# Altium project remora-2.PrjPCB
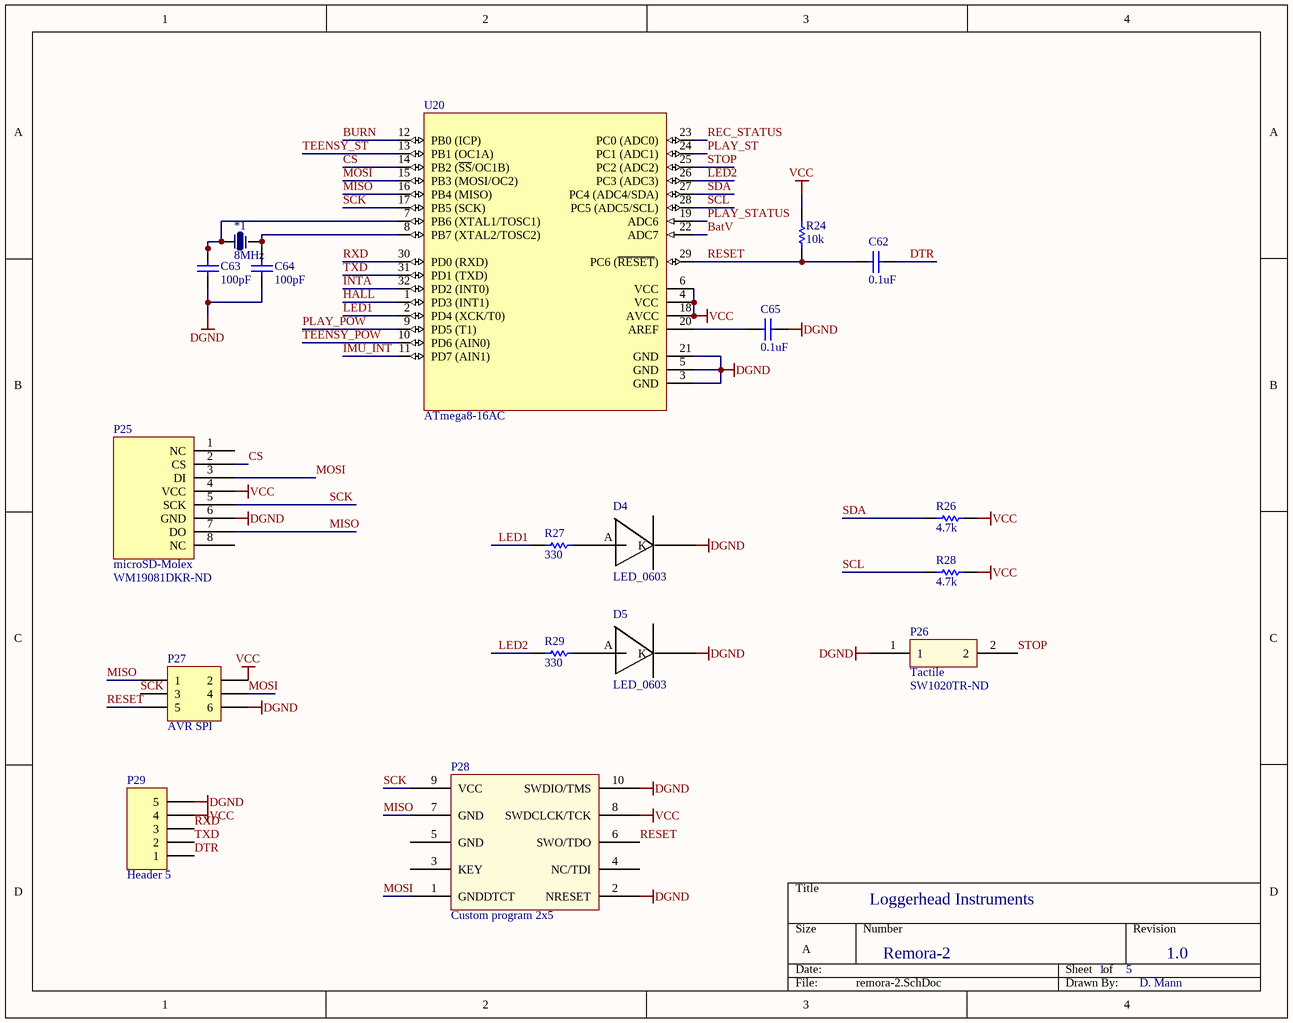
[diagram p0: remora-2.SchDoc]
5 sheets, 128 parts. Net scope: global (net labels, ports and power ports of the same name join across sheets).
Board file: remora-2.PcbDoc
Sheets:
  remora-2.SchDoc
  remora-2-sensors.SchDoc
  remora-2-power.SchDoc
  teensyRecord.SchDoc
  teensyPlayback.SchDoc

## Sheet remora-2.SchDoc
size A

### Parts
*1  8MHz  [XTAL-ABM3]
C62  0.1uF  [0402]
C63  100pF  [0402]
C64  100pF  [0402]
C65  0.1uF  [0402]
D4  LED_0603  [Diode0603]
D5  LED_0603  [Diode0603]
P25  microSD-Molex  Supplier Part Number 1: WM19081DKR-ND  [microSD_Molex_hinged]
P26  Tactile  Supplier Part Number 1: SW1020TR-ND  [Tactile-B3U-1000]
P27  AVR SPI  [HDR2X3]
P28  Custom program 2x5  [Header_2x5_50mil]
P29  Header 5  [HDR1X5]
R24  10k  [3-0603]
R26  4.7k  [3-0603]
R27  330  [3-0603]
R28  4.7k  [3-0603]
R29  330  [3-0603]
U20  ATmega8-16AC  [32M1-A_M]

### Nets
DGND: C63.1 C64.1 C65.2 D4.K D5.K P25.6(GND) P26.1 P27.6 P28.2(NRESET) P28.10(SWDIO/TMS) P29.5 U20.3(GND) U20.5(GND) U20.21(GND)
VCC: P25.4(VCC) P27.2 P28.8(SWDCLCK/TCK) P29.4 R24.2 R26.2 R28.2 U20.4(VCC) U20.6(VCC) U20.18(AVCC)
BatV: U20.22(ADC7)
BURN: U20.12(PB0_(ICP))
CS: P25.2(CS) U20.14(PB2_(~{SS}/OC1B))
DTR: C62.2 P29.1
HALL: U20.1(PD3_(INT1))
IMU_INT: U20.11(PD7_(AIN1))
INTA: U20.32(PD2_(INT0))
LED1: R27.1 U20.2(PD4_(XCK/T0))
LED2: R29.1 U20.26(PC3_(ADC3))
MISO: P25.7(DO) P27.1 P28.7(GND) U20.16(PB4_(MISO))
MOSI: P25.3(DI) P27.4 P28.1(GNDDTCT) U20.15(PB3_(MOSI/OC2))
PLAY_POW: U20.9(PD5_(T1))
PLAY_ST: U20.24(PC1_(ADC1))
PLAY_STATUS: U20.19(ADC6)
REC_STATUS: U20.23(PC0_(ADC0))
RESET: C62.1 P27.5 P28.6(SWO/TDO) R24.1 U20.29(PC6_(~{RESET}))
RXD: P29.3 U20.30(PD0_(RXD))
SCK: P25.5(SCK) P27.3 P28.9(VCC) U20.17(PB5_(SCK))
SCL: R28.1 U20.28(PC5_(ADC5/SCL))
SDA: R26.1 U20.27(PC4_(ADC4/SDA))
STOP: P26.2 U20.25(PC2_(ADC2))
TEENSY_POW: U20.10(PD6_(AIN0))
TEENSY_ST: U20.13(PB1_(OC1A))
TXD: P29.2 U20.31(PD1_(TXD))
Net*1_1: *1.1 C63.2 U20.7(PB6_(XTAL1/TOSC1))
Net*1_2: *1.2 C64.2 U20.8(PB7_(XTAL2/TOSC2))
NetC65_1: C65.1 U20.20(AREF)
NetD4_A: D4.A R27.2
NetD5_A: D5.A R29.2

Not connected (* = marked no-connect by the designer): P25 1(NC) 8(NC); P28 3(KEY) 4(NC/TDI) 5(GND)

### Notes on the sheet
- Loggerhead Instruments
- Remora-2
- 1
- 5
- 1.0
- D. Mann

### Library data of the parts
*1 = XTAL-ABM3
C62-C65 = C0402: Ceramic Chip Capacitor - Standard; Note: Footprint corresponds to dimensions for bulk cassette packaging. This case size has tightened tolerances.; Published: 17-Jul-2002; LatestRevisionDate: 19-Mar-2004; LatestRevisionNote: Silkscreen size reduced.; DatasheetDocument: Mar-2001; PackageDocument: Mar-2001; PackageReference: 0402; Publisher: Altium Limited; Code_JEITA: 0402; Code_IPC: 1005 [0402]; ComponentLink1Description: Manufacturer Link; ComponentLink1URL: http://www.kemet.com/; ComponentLink2Description: Datasheet; ComponentLink2URL: http://www.kemet.com/kemet/web/homepage/kechome.nsf/vapubfilesname/F3102TA.pdf/$file/F3102TA.pdf
  C62 C65: Value: 0.1uF
  C63 C64: Value: 100pF
P25 = microSD_Molex_hinged: Supplier 1: Digi-Key
P26 = Tactile_B3U-1000: Supplier 1: Digi-Key
P27 = Header 3X2: Header, 3-Pin, Dual row; LatestRevisionDate: 17-Jul-2002; LatestRevisionNote: Re-released for DXP Platform.; Publisher: Altium Limited
P28 = CortexDebug
P29 = Header 5: Header, 5-Pin; LatestRevisionDate: 17-Jul-2002; LatestRevisionNote: Re-released for DXP Platform.; Publisher: Altium Limited
R24 R26-R29 = ERJ3RK: Precision Thick Film Chip Resistor, 10 Ohm to 1M Ohm Range, 1% and 0.5% Tolerance, 0603 Size, 0.063 W; Published: 17-Dec-2003; LatestRevisionDate: 19-Mar-2004; LatestRevisionNote: Silkscreen size reduced.; PackageDocument: Mar-2003; PackageReference: 3-0603; Publisher: Altium Limited; Code_IPC: 1608 [0603]; ComponentLink1Description: Manufacturer Link; ComponentLink1URL: http://www.panasonic.com/industrial/components/resistive_products.htm; ComponentLink2Description: Datasheet; ComponentLink2URL: http://www.panasonic.com/industrial/components/pdf/AOA0000CE2.pdf
U20 = ATmega8-16AC: 8-Bit AVR Microcontroller with 8K Bytes of In-System Programmable Flash Memory; Published: 17-Sep-2003; LatestRevisionDate: 13-Apr-2006; LatestRevisionNote: IPC-7351 Footprint Added.; DatasheetVersion: 2486H-AVR-09/02; PackageVersion: revB, Oct-2001; PackageReference: 32A; Publisher: Altium Limited; PackageDescription: 32-Pin Thin Quad Flat Pack 0.8 mm Pitch; Code_JEDEC: MS-026-ABA; ComponentLink1Description: Manufacturer Link; ComponentLink1URL: http://www.atmel.com; ComponentLink2Description: Datasheet; ComponentLink2URL: http://www.atmel.com/dyn/resources/prod_documents/doc2486.pdf

## Sheet remora-2-sensors.SchDoc
size Legal
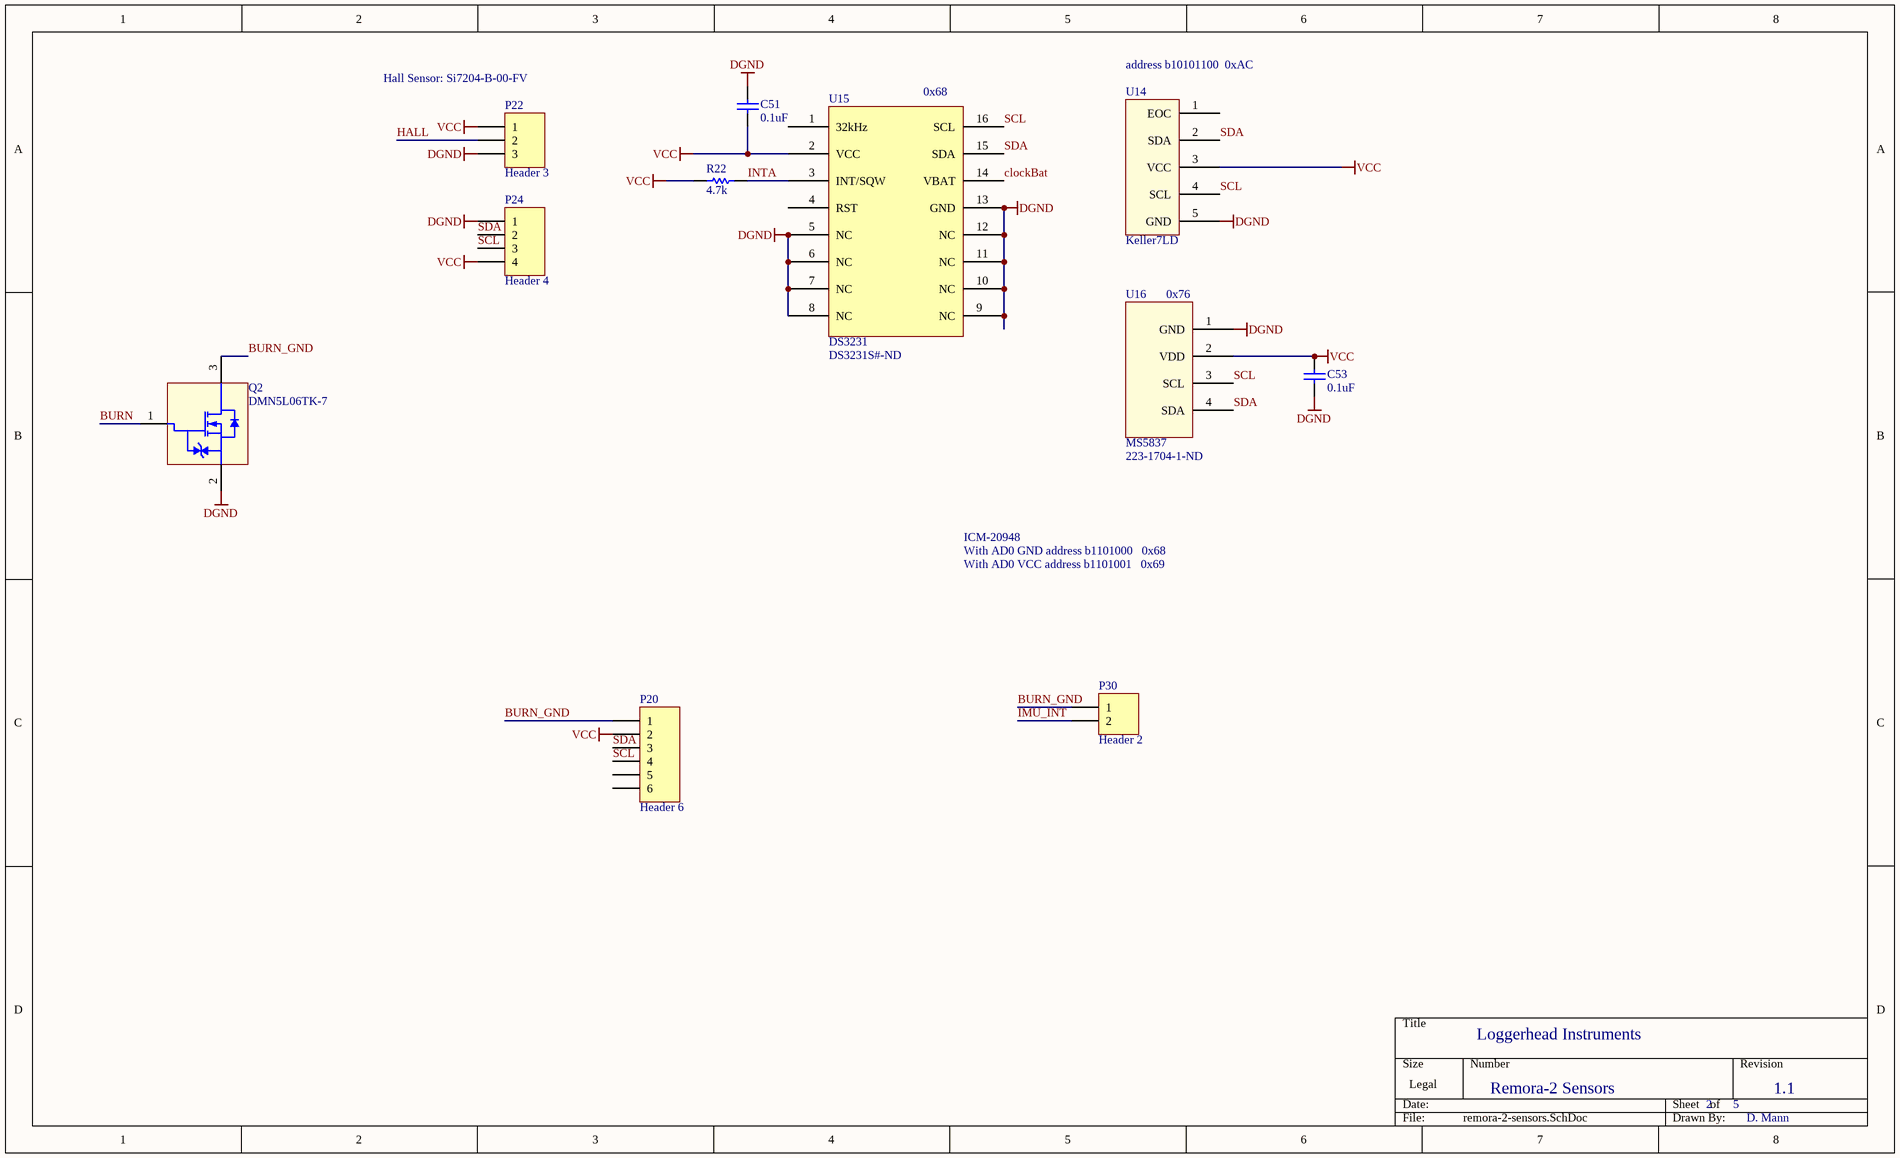
[diagram p1: remora-2-sensors.SchDoc]

### Parts
C51  0.1uF  [0402]
C53  0.1uF  [0402]
P20  Header 6  [HDR1X6]
P22  Header 3  [HDR1X3]
P24  Header 4  [HDR1X4]
P30  Header 2  [HDR1X2]
Q2  DMN5L06TK-7  [SOT-523]
R22  4.7k  [3-0603]
U14  Keller7LD  [Keller7LD]
U15  DS3231  Supplier Part Number 1: DS3231S#-ND  [DS3231]
U16  MS5837  Supplier Part Number 1: 223-1704-1-ND  [MS5837]

### Nets
DGND: C51.1 C53.1 P22.3 P24.1 Q2.2(S) U14.5(GND) U15.5(NC) U15.6(NC) U15.7(NC) U15.8(NC) U15.9(NC) U15.10(NC) U15.11(NC) U15.12(NC) U15.13(GND) U16.1(GND)
VCC: C51.2 C53.2 P20.2 P22.1 P24.4 R22.1 U14.3(VCC) U15.2(VCC) U16.2(VDD)
BURN: Q2.1(G)
BURN_GND: P20.1 P30.1 Q2.3(D)
clockBat: U15.14(VBAT)
HALL: P22.2
IMU_INT: P30.2
INTA: R22.2 U15.3(INT/SQW)
SCL: P20.4 P24.3 U14.4(SCL) U15.16(SCL) U16.3(SCL)
SDA: P20.3 P24.2 U14.2(SDA) U15.15(SDA) U16.4(SDA)

Not connected (* = marked no-connect by the designer): P20 5 6; U14 1(EOC); U15 1(32kHz) 4(RST)

### Notes on the sheet
- (near P22) Hall Sensor: Si7204-B-00-FV
- (near U15) 0x68
- (near U14) address b10101100  0xAC
- (near U16) 0x76
- With AD0 GND address b1101000   0x68
- With AD0 VCC address b1101001   0x69
- ICM-20948
- Loggerhead Instruments
- Remora-2 Sensors
- 2
- 5
- 1.1
- D. Mann

### Library data of the parts
C51 = C0402: Ceramic Chip Capacitor - Standard; Note: Footprint corresponds to dimensions for bulk cassette packaging. This case size has tightened tolerances.; Value: 10nF; Published: 17-Jul-2002; LatestRevisionDate: 19-Mar-2004; LatestRevisionNote: Silkscreen size reduced.; DatasheetDocument: Mar-2001; PackageDocument: Mar-2001; PackageReference: 0402; Publisher: Altium Limited; Code_JEITA: 0402; Code_IPC: 1005 [0402]; ComponentLink1Description: Manufacturer Link; ComponentLink1URL: http://www.kemet.com/; ComponentLink2Description: Datasheet; ComponentLink2URL: http://www.kemet.com/kemet/web/homepage/kechome.nsf/vapubfilesname/F3102TA.pdf/$file/F3102TA.pdf
C53 = C0402: as C62 on sheet remora-2; Published: 17-Jul-2002; LatestRevisionDate: 19-Mar-2004; LatestRevisionNote: Silkscreen size reduced.; DatasheetDocument: Mar-2001; PackageDocument: Mar-2001; PackageReference: 0402; Publisher: Altium Limited; Code_JEITA: 0402; Code_IPC: 1005 [0402]; ComponentLink1Description: Manufacturer Link; ComponentLink1URL: http://www.kemet.com/; ComponentLink2Description: Datasheet; ComponentLink2URL: http://www.kemet.com/kemet/web/homepage/kechome.nsf/vapubfilesname/F3102TA.pdf/$file/F3102TA.pdf; Value: 0.1uF
P20 = Header 6: Header, 6-Pin; LatestRevisionDate: 17-Jul-2002; LatestRevisionNote: Re-released for DXP Platform.; Publisher: Altium Limited
P22 = Header 3: Header, 3-Pin; LatestRevisionDate: 17-Jul-2002; LatestRevisionNote: Re-released for DXP Platform.; Publisher: Altium Limited
P24 = Header 4: Header, 4-Pin; LatestRevisionDate: 17-Jul-2002; LatestRevisionNote: Re-released for DXP Platform.; Publisher: Altium Limited
P30 = Header 2: Header, 2-Pin; LatestRevisionDate: 17-Jul-2002; LatestRevisionNote: Re-released for DXP Platform.; Publisher: Altium Limited
Q2 = FET DMN5L06TK-7: Ultra-low leakage Enhanced MOSFET; Fabrication Tested: NO; Creator and Date: Will Flanery 2010-09-02; Footprint Verified By: *; Schematic Verified By: *; Vendor Info Verified By: *; Supplier 1: Digi-Key; Supplier Part Number 1: DMN5L06TKDICT-ND; HelpURL: http://www.diodes.com/datasheets/ds30926.pdf
R22 = ERJ3RK: as R24 on sheet remora-2; Published: 17-Dec-2003; LatestRevisionDate: 19-Mar-2004; LatestRevisionNote: Silkscreen size reduced.; PackageDocument: Mar-2003; PackageReference: 3-0603; Publisher: Altium Limited; Code_IPC: 1608 [0603]; ComponentLink1Description: Manufacturer Link; ComponentLink1URL: http://www.panasonic.com/industrial/components/resistive_products.htm; ComponentLink2Description: Datasheet; ComponentLink2URL: http://www.panasonic.com/industrial/components/pdf/AOA0000CE2.pdf
U14 = Keller 7LD: Keller Pressure/Temp; PDF: http://www.kelleramerica.com/pdf-library/Piezoresistive%20OEM%20Pressure%20Transmitters%20with%20I2C%20interface%20and%20embedded%20signal%20conditioning.pdf
U16 = MS5837: Pressure/Temp; Supplier 1: Digi-Key
U15 = DS3231: Supplier 1: Digi-Key

## Sheet remora-2-power.SchDoc
size A
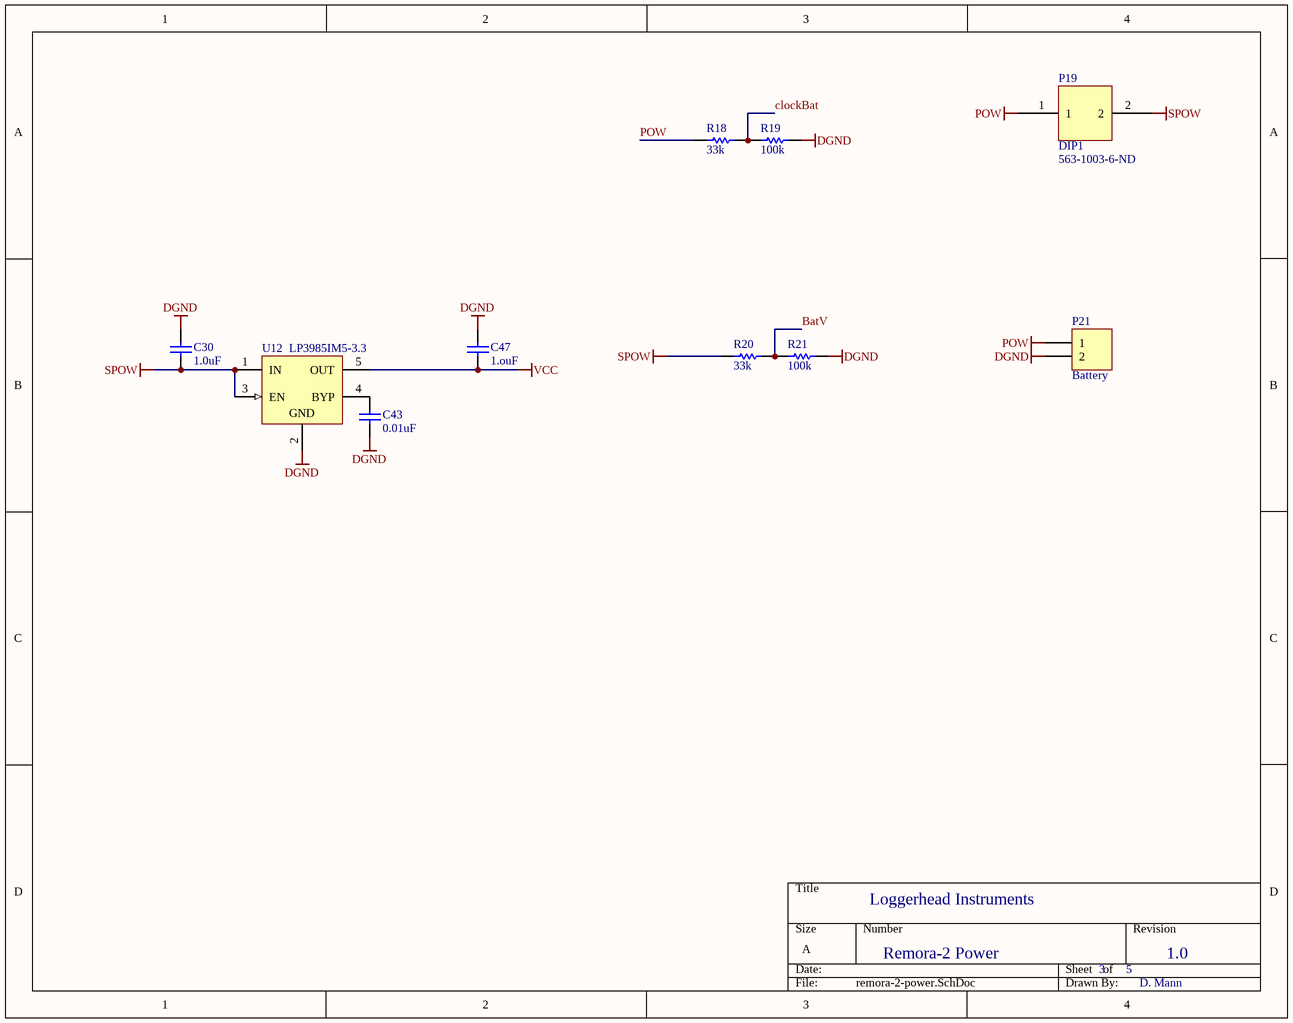
[diagram p2: remora-2-power.SchDoc]

### Parts
C30  1.0uF  [0402]
C43  0.01uF  [0402]
C47  1.ouF  [0402]
P19  DIP1  Supplier Part Number 1: 563-1003-6-ND  [DIP1]
P21  Battery  [HDR1X2]
R18  33k  [3-0603]
R19  100k  [3-0603]
R20  33k  [3-0603]
R21  100k  [3-0603]
U12  LP3985IM5-3.3  [MF05A_N]

### Nets
DGND: C30.2 C43.1 C47.2 P21.2 R19.1 R21.1 U12.2(GND)
POW: P19.1 P21.1 R18.2
SPOW: C30.1 P19.2 R20.2 U12.1(IN) U12.3(EN)
VCC: C47.1 U12.5(OUT)
BatV: R20.1 R21.2
clockBat: R18.1 R19.2
NetC43_2: C43.2 U12.4(BYP)

### Notes on the sheet
- Loggerhead Instruments
- Remora-2 Power
- 3
- 5
- 1.0
- D. Mann

### Library data of the parts
C30 C43 C47 = C0402: Ceramic Chip Capacitor - Standard; Note: Footprint corresponds to dimensions for bulk cassette packaging. This case size has tightened tolerances.; Value: 0.1uF; Published: 17-Jul-2002; LatestRevisionDate: 19-Mar-2004; LatestRevisionNote: Silkscreen size reduced.; DatasheetDocument: Mar-2001; PackageDocument: Mar-2001; PackageReference: 0402; Publisher: Altium Limited; Code_JEITA: 0402; Code_IPC: 1005 [0402]; ComponentLink1Description: Manufacturer Link; ComponentLink1URL: http://www.kemet.com/; ComponentLink2Description: Datasheet; ComponentLink2URL: http://www.kemet.com/kemet/web/homepage/kechome.nsf/vapubfilesname/F3102TA.pdf/$file/F3102TA.pdf
P21 = Header 2: Header, 2-Pin; LatestRevisionDate: 17-Jul-2002; LatestRevisionNote: Re-released for DXP Platform.; Publisher: Altium Limited
R18-R21 = ERJ3RK: as R24 on sheet remora-2; Published: 17-Dec-2003; LatestRevisionDate: 19-Mar-2004; LatestRevisionNote: Silkscreen size reduced.; PackageDocument: Mar-2003; PackageReference: 3-0603; Publisher: Altium Limited; Code_IPC: 1608 [0603]; ComponentLink1Description: Manufacturer Link; ComponentLink1URL: http://www.panasonic.com/industrial/components/resistive_products.htm; ComponentLink2Description: Datasheet; ComponentLink2URL: http://www.panasonic.com/industrial/components/pdf/AOA0000CE2.pdf
U12 = LP3985IM5-3.3: Micropower, 150mA Low-Noise Ultra Low-Dropout CMOS Voltage Regulator; Manufacturer: National Semiconductor; CompType: LDO IC; PackageTopMarking: LDQB*XTT; PowerWise: N; Published: 4-Dec-2008; DatasheetVersion: Aug-2005; PackageVersion: revD, Aug-2008; PackageReference: MF05A; Publisher: Altium Limited; PackageDescription: Molded SOT-23, .115 x .063 x .040 in Body, 5 Lead, .0375 in Pitch; PartNumber: LP3985IM5-3.3; RoHS: O; PinCount: 5; DigiKeyPartNumber: LP3985IM5-3.3CT-ND; ComponentLink1Description: LP3985 Datasheet; ComponentLink1URL: http://www.national.com/ds/LP/LP3985.pdf; ComponentLink2Description: LP3985 Web Page; ComponentLink2URL: http://www.national.com/pf/LP/LP3985.html; ComponentLink3Description: MF05A Package Page; ComponentLink3URL: http://www.national.com/packaging/folders/mf05a.html
P19 = DIP1: Supplier 1: Digi-Key

## Sheet teensyRecord.SchDoc
size Legal
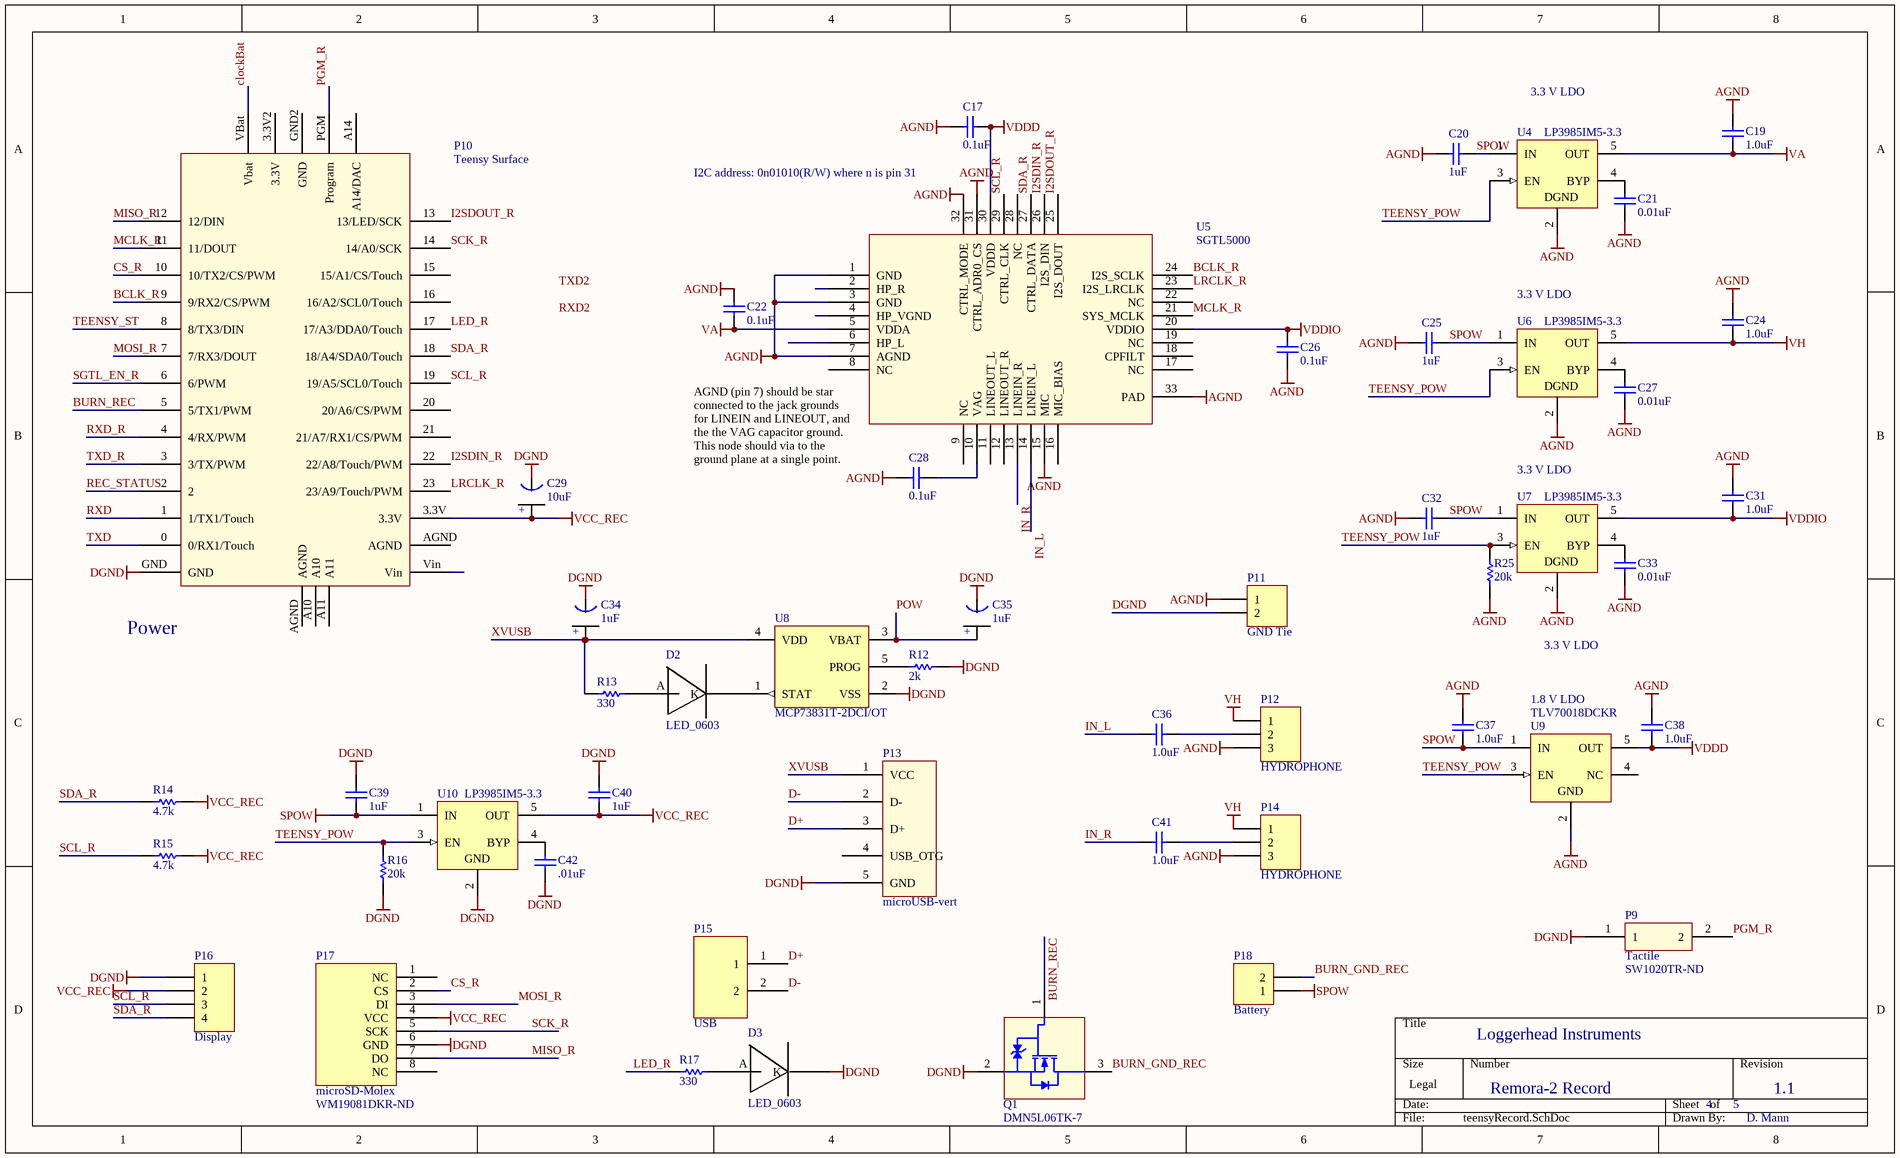
[diagram p3: teensyRecord.SchDoc]

### Parts
C17  0.1uF  [0402]
C19  1.0uF  [0402]
C20  1uF  [0402]
C21  0.01uF  [0402]
C22  0.1uF  [0402]
C24  1.0uF  [0402]
C25  1uF  [0402]
C26  0.1uF  [0402]
C27  0.01uF  [0402]
C28  0.1uF  [0402]
C29  10uF  [Tant0805]
C31  1.0uF  [0402]
C32  1uF  [0402]
C33  0.01uF  [0402]
C34  1uF  [Tant0805]
C35  1uF  [Tant0805]
C36  1.0uF  [0402]
C37  1.0uF  [0402]
C38  1.0uF  [0402]
C39  1uF  [0402]
C40  1uF  [0402]
C41  1.0uF  [0402]
C42  .01uF  [0402]
D2  LED_0603  [Diode0603]
D3  LED_0603  [Diode0603]
P9  Tactile  Supplier Part Number 1: SW1020TR-ND  [Tactile-B3U-1000]
P10  Teensy Surface  [TEENSY3.2_surface_mount]
P11  GND Tie  [HDR1X2]
P12  HYDROPHONE  [HDR1X3]
P13  microUSB-vert  [MICROUSB-VERT]
P14  HYDROPHONE  [HDR1X3]
P15  USB  [HDR_2x1_2mm]
P16  Display  [HDR1X4]
P17  microSD-Molex  Supplier Part Number 1: WM19081DKR-ND  [microSD_Molex_hinged]
P18  Battery  [HDR1X2]
Q1  DMN5L06TK-7  [SOT-523]
R12  2k  [3-0603]
R13  330  [3-0603]
R14  4.7k  [3-0603]
R15  4.7k  [3-0603]
R16  20k  [3-0603]
R17  330  [3-0603]
R25  20k  [3-0603]
U4  LP3985IM5-3.3  [MF05A_N]
U5  SGTL5000  [QFN32]
U6  LP3985IM5-3.3  [MF05A_N]
U7  LP3985IM5-3.3  [MF05A_N]
U8  MCP73831T-2DCI/OT  [SOT-23-OT5_N]
U9  TLV70018DCKR  [TI-DCK5_V]
U10  LP3985IM5-3.3  [MF05A_N]

### Nets
AGND: C17.2 C19.2 C20.2 C21.2 C22.2 C24.2 C25.2 C26.2 C27.2 C28.2 C31.2 C32.2 C33.2 C37.2 C38.2 P11.1 P12.3 P14.3 R25.2 U4.2(GND) U5.1(GND) U5.3(GND) U5.7(AGND) U5.15(MIC) U5.31(CTRL_ADR0_CS) U5.32(CTRL_MODE) U5.33(PAD) U6.2(GND) U7.2(GND) U9.2(GND)
DGND: C29.1(GND) C34.1(GND) C35.1(GND) C39.2 C40.2 C42.1 D3.K P9.1 P10.GND P11.2 P13.5(GND) P16.1 P17.6(GND) Q1.2(S) R12.1 R16.1 U8.2(VSS) U10.2(GND)
POW: C35.2(+) U8.3(VBAT)
SPOW: C20.1 C25.1 C32.1 C37.1 C39.1 P18.1 U4.1(IN) U6.1(IN) U7.1(IN) U9.1(IN) U10.1(IN)
VA: C19.1 C22.1 U4.5(OUT) U5.5(VDDA)
VCC_REC: C29.2(+) C40.1 P10.3.3V P16.2 P17.4(VCC) R14.2 R15.2 U10.5(OUT)
VDDD: C17.1 C38.1 U5.30(VDDD) U9.5(OUT)
VDDIO: C26.1 C31.1 U5.20(VDDIO) U7.5(OUT)
VH: C24.1 P12.1 P14.1 U6.5(OUT)
BCLK_R: P10.9(9/RX2/CS/PWM) U5.24(I2S_SCLK)
BURN_GND_REC: P18.2 Q1.3(D)
BURN_REC: P10.5(5/TX1/PWM) Q1.1(G)
clockBat: P10.VBat(Vbat)
CS_R: P10.10(10/TX2/CS/PWM) P17.2(CS)
D+: P13.3(D+) P15.1
D-: P13.2(D-) P15.2
I2SDIN_R: P10.22(22/A8/Touch/PWM) U5.26(I2S_DIN)
I2SDOUT_R: P10.13(13/LED/SCK) U5.25(I2S_DOUT)
IN_L: C36.2 U5.14(LINEIN_L)
IN_R: C41.2 U5.13(LINEIN_R)
LED_R: P10.17(17/A3/DDA0/Touch) R17.1
LRCLK_R: P10.23(23/A9/Touch/PWM) U5.23(I2S_LRCLK)
MCLK_R: P10.11(11/DOUT) U5.21(SYS_MCLK)
MISO_R: P10.12(12/DIN) P17.7(DO)
MOSI_R: P10.7(7/RX3/DOUT) P17.3(DI)
PGM_R: P9.2 P10.PGM(Program)
REC_STATUS: P10.2
RXD: P10.1(1/TX1/Touch)
RXD_R: P10.4(4/RX/PWM)
SCK_R: P10.14(14/A0/SCK) P17.5(SCK)
SCL_R: P10.19(19/A5/SCL0/Touch) P16.3 R15.1 U5.29(CTRL_CLK)
SDA_R: P10.18(18/A4/SDA0/Touch) P16.4 R14.1 U5.27(CTRL_DATA)
SGTL_EN_R: P10.6(6/PWM)
TEENSY_POW: R16.2 R25.1 U4.3(EN) U6.3(EN) U7.3(EN) U9.3(EN) U10.3(EN)
TEENSY_ST: P10.8(8/TX3/DIN)
TXD: P10.0(0/RX1/Touch)
TXD_R: P10.3(3/TX/PWM)
XVUSB: C34.2(+) P13.1(VCC) R13.1 U8.4(VDD)
NetC21_1: C21.1 U4.4(BYP)
NetC27_1: C27.1 U6.4(BYP)
NetC28_1: C28.1 U5.10(VAG)
NetC33_1: C33.1 U7.4(BYP)
NetC36_1: C36.1 P12.2
NetC41_1: C41.1 P14.2
NetC42_2: C42.2 U10.4(BYP)
NetD2_A: D2.A R13.2
NetD2_K: D2.K U8.1(STAT)
NetD3_A: D3.A R17.2
NetR12_2: R12.2 U8.5(PROG)

Not connected (* = marked no-connect by the designer): P10 3.3V2(3.3V) 15(15/A1/CS/Touch) 16(16/A2/SCL0/Touch) 20(20/A6/CS/PWM) 21(21/A7/RX1/CS/PWM) A10 A11 A14(A14/DAC) AGND GND2(GND) Vin; P13 4(USB_OTG); P17 1(NC) 8(NC); U5 2(HP_R) 4(HP_VGND) 6(HP_L) 8(NC) 9(NC) 11(LINEOUT_L) 12(LINEOUT_R) 16(MIC_BIAS) 17(NC) 18(CPFILT) 19(NC) 22(NC) 28(NC); U9 4(NC)

### Notes on the sheet
- 3.3 V LDO
- I2C address: 0n01010(R/W) where n is pin 31
- (near U6) 3.3 V LDO
- (near U5) AGND (pin 7) should be star connected to the jack grounds for LINEIN and LINEOUT, and the the VAG capacitor ground. This node should via to the ground plane at a single point.
- (near U7) 3.3 V LDO
- (near P10) Power
- (near U9) 1.8 V LDO
- Loggerhead Instruments
- Remora-2 Record
- 4
- 5
- 1.1
- D. Mann
- Labels drawn without touching a wire or pin: RXD2, TXD2
- (in symbol LP3985IM5-3.3) DGND

### Library data of the parts
C17 C22 C26 C28 = C0402: as C62 on sheet remora-2; Published: 17-Jul-2002; LatestRevisionDate: 19-Mar-2004; LatestRevisionNote: Silkscreen size reduced.; DatasheetDocument: Mar-2001; PackageDocument: Mar-2001; PackageReference: 0402; Publisher: Altium Limited; Code_JEITA: 0402; Code_IPC: 1005 [0402]; ComponentLink1Description: Manufacturer Link; ComponentLink1URL: http://www.kemet.com/; ComponentLink2Description: Datasheet; ComponentLink2URL: http://www.kemet.com/kemet/web/homepage/kechome.nsf/vapubfilesname/F3102TA.pdf/$file/F3102TA.pdf; Value: 0.1uF
C19-C21 C24 C25 C27 C31-C33 C36-C42 = C0402: as C30 on sheet remora-2-power; Published: 17-Jul-2002; LatestRevisionDate: 19-Mar-2004; LatestRevisionNote: Silkscreen size reduced.; DatasheetDocument: Mar-2001; PackageDocument: Mar-2001; PackageReference: 0402; Publisher: Altium Limited; Code_JEITA: 0402; Code_IPC: 1005 [0402]; ComponentLink1Description: Manufacturer Link; ComponentLink1URL: http://www.kemet.com/; ComponentLink2Description: Datasheet; ComponentLink2URL: http://www.kemet.com/kemet/web/homepage/kechome.nsf/vapubfilesname/F3102TA.pdf/$file/F3102TA.pdf
C29 C34 C35 = Tant0805
  C29: Value: 10uF
  C34 C35: Value: 1uF
P9 = Tactile_B3U-1000: Supplier 1: Digi-Key
P10 = Teensy3.2_surface_mount
P11 P18 = Header 2: Header, 2-Pin; LatestRevisionDate: 17-Jul-2002; LatestRevisionNote: Re-released for DXP Platform.; Publisher: Altium Limited
P12 P14 = Header 3: Header, 3-Pin; LatestRevisionDate: 17-Jul-2002; LatestRevisionNote: Re-released for DXP Platform.; Publisher: Altium Limited
P13 = microUSB-vert: Molex 105133-0011
P15 = HDR_2x1_2mm: Charging Connector
P16 = Header 4: Header, 4-Pin; LatestRevisionDate: 17-Jul-2002; LatestRevisionNote: Re-released for DXP Platform.; Publisher: Altium Limited
P17 = microSD_Molex_hinged: Supplier 1: Digi-Key
Q1 = FET DMN5L06TK-7: as Q2 on sheet remora-2-sensors; Creator and Date: Will Flanery 2010-09-02; Footprint Verified By: *; Schematic Verified By: *; Vendor Info Verified By: *; Supplier 1: Digi-Key; Supplier Part Number 1: DMN5L06TKDICT-ND; HelpURL: http://www.diodes.com/datasheets/ds30926.pdf
R12-R17 R25 = ERJ3RK: as R24 on sheet remora-2; Published: 17-Dec-2003; LatestRevisionDate: 19-Mar-2004; LatestRevisionNote: Silkscreen size reduced.; PackageDocument: Mar-2003; PackageReference: 3-0603; Publisher: Altium Limited; Code_IPC: 1608 [0603]; ComponentLink1Description: Manufacturer Link; ComponentLink1URL: http://www.panasonic.com/industrial/components/resistive_products.htm; ComponentLink2Description: Datasheet; ComponentLink2URL: http://www.panasonic.com/industrial/components/pdf/AOA0000CE2.pdf
U4 U6 U7 U10 = LP3985IM5-3.3: as U12 on sheet remora-2-power; Published: 4-Dec-2008; DatasheetVersion: Aug-2005; PackageVersion: revD, Aug-2008; PackageReference: MF05A; Publisher: Altium Limited; PackageDescription: Molded SOT-23, .115 x .063 x .040 in Body, 5 Lead, .0375 in Pitch; PartNumber: LP3985IM5-3.3; RoHS: O; PinCount: 5; DigiKeyPartNumber: LP3985IM5-3.3CT-ND; ComponentLink1Description: LP3985 Datasheet; ComponentLink1URL: http://www.national.com/ds/LP/LP3985.pdf; ComponentLink2Description: LP3985 Web Page; ComponentLink2URL: http://www.national.com/pf/LP/LP3985.html; ComponentLink3Description: MF05A Package Page; ComponentLink3URL: http://www.national.com/packaging/folders/mf05a.html
U8 = MCP73831T-2DCI/OT: Miniature Single-Cell, Fully Integrated Li-Ion, Li-Polymer Charge Management Controller, 4.2V, 5-Pin SOT-23, Industrial Temperature, Tape and Reel; DatasheetVersion: revE, Sep-2008; PackageVersion: revBB, Aug-2009; PackageReference: SOT-23-OT5; PackageDescription: 5-Lead Plastic Small Outline Transistor (OT) [SOT-23]; Code_IPC: SOT23-5; ComponentLink1Description: Manufacturer URL; ComponentLink1URL: http://www.microchip.com/; ComponentLink2Description: Datasheet; ComponentLink2URL: http://ww1.microchip.com/downloads/en/DeviceDoc/21984e.pdf; ComponentLink3Description: Package Specification; ComponentLink3URL: http://www.microchip.com/stellent/groups/techpub_sg/documents/packagingspec/en012702.pdf
U9 = TLV70018DCKR: Single Output LDO, 200 mA, Fixed 1.8 V Output, 2 to 5.5 V Input, with Low IQ, 5-pin SC70 (DCK), -40 to 125 degC, Green (RoHS & no Sb/Br); Manufacturer: Texas Instruments; Accuracy(%): 2; Fixed Output Options(V): 1.8; Iout(Max)(A): 0.2; Iq(Typ)(mA): 0.03; SubFamily: Single Channel LDO; Vdo(Typ)(mV): 175; Vin(Max)(V): 5.5; DatasheetVersion: SLVSA00D; PackageVersion: 4093553-3/G; PackageReference: DCK5; PackageDescription: 5-Pin Plastic Small-Outline, Body 2 x 1.25 mm, Pitch 0.65 mm; Supplier 1: Digi-Key; Supplier Part Number 1: 296-32409-2-ND; Supplier 2: Digi-Key; Supplier Part Number 2: 296-32409-1-ND; Supplier 3: Digi-Key; Supplier Part Number 3: 296-32409-6-ND; Supplier 4: Newark; Supplier Part Number 4: 55R7461; Supplier 5: Mouser; Supplier Part Number 5: 595-TLV70018DCKR; Eco-Plan: Green (RoHS & no Sb/Br); Vin(Min)(V): 2; Vout Adj(Max)(V): 1.8; Vout Adj(Min)(V): 1.8; Mounting Technology: Surface Mount; Code_JEDEC: MO-203; PartNumber: TLV70018DCKR; ComponentLink1Description: Manufacturer URL; ComponentLink1URL: http://www.ti.com/; ComponentLink2Description: Datasheet; ComponentLink2URL: http://www.ti.com/general/docs/lit/getliterature.tsp?genericPartNumber=TLV70018&fileType=pdf; ComponentLink3Description: Package Specification; ComponentLink3URL: http://www.ti.com/litv/pdf/mpds025f

## Sheet teensyPlayback.SchDoc
size Legal
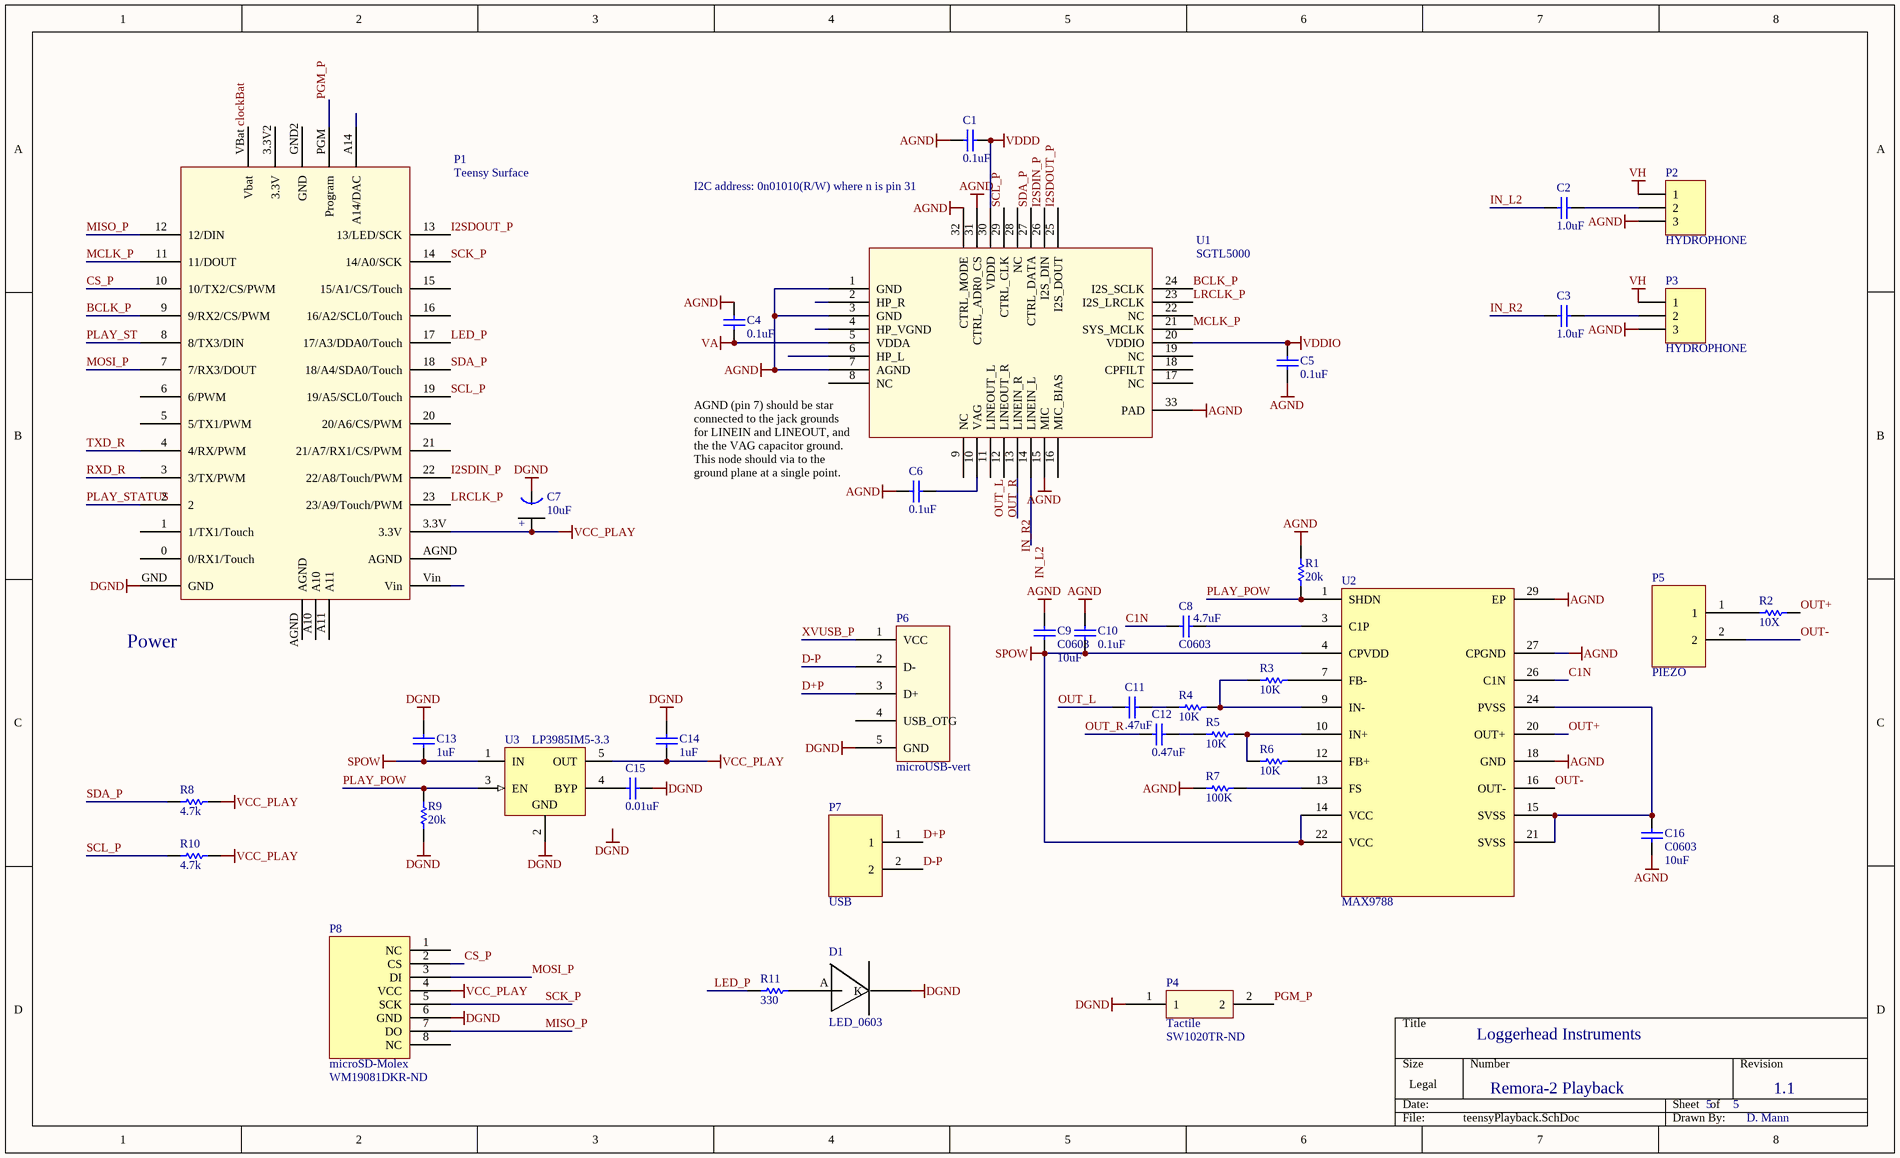
[diagram p4: teensyPlayback.SchDoc]

### Parts
C1  0.1uF  [0402]
C2  1.0uF  [0402]
C3  1.0uF  [0402]
C4  0.1uF  [0402]
C5  0.1uF  [0402]
C6  0.1uF  [0402]
C7  10uF  [Tant0805]
C8  C0603  value 4.7uF  [0603]
C9  C0603  value 10uF  [0603]
C10  0.1uF  [0402]
C11  .47uF  [0402]
C12  0.47uF  [0402]
C13  1uF  [0402]
C14  1uF  [0402]
C15  0.01uF  [0402]
C16  C0603  value 10uF  [0603]
D1  LED_0603  [Diode0603]
P1  Teensy Surface  [TEENSY3.2_surface_mount]
P2  HYDROPHONE  [HDR1X3]
P3  HYDROPHONE  [HDR1X3]
P4  Tactile  Supplier Part Number 1: SW1020TR-ND  [Tactile-B3U-1000]
P5  PIEZO  [HDR_2x1_2mm]
P6  microUSB-vert  [MICROUSB-VERT]
P7  USB  [HDR_2x1_2mm]
P8  microSD-Molex  Supplier Part Number 1: WM19081DKR-ND  [microSD_Molex_hinged]
R1  20k  [3-0603]
R2  10X  [3-0603]
R3  10K  [3-0603]
R4  10K  [3-0603]
R5  10K  [3-0603]
R6  10K  [3-0603]
R7  100K  [3-0603]
R8  4.7k  [3-0603]
R9  20k  [3-0603]
R10  4.7k  [3-0603]
R11  330  [3-0603]
U1  SGTL5000  [QFN32]
U2  MAX9788  [MAX9788]
U3  LP3985IM5-3.3  [MF05A_N]

### Nets
AGND: C1.2 C4.2 C5.2 C6.2 C9.1 C10.2 C16.1 P2.3 P3.3 R1.1 R7.1 U1.1(GND) U1.3(GND) U1.7(AGND) U1.15(MIC) U1.31(CTRL_ADR0_CS) U1.32(CTRL_MODE) U1.33(PAD) U2.18(GND) U2.27(CPGND) U2.29(EP)
DGND: C7.1(GND) C13.2 C14.2 C15.2 D1.K P1.GND P4.1 P6.5(GND) P8.6(GND) R9.1 U3.2(GND)
SPOW: C9.2 C10.1 C13.1 U2.4(CPVDD) U2.14(VCC) U2.22(VCC) U3.1(IN)
VA: C4.1 U1.5(VDDA)
VCC_PLAY: C7.2(+) C14.1 P1.3.3V P8.4(VCC) R8.2 R10.2 U3.5(OUT)
VDDD: C1.1 U1.30(VDDD)
VDDIO: C5.1 U1.20(VDDIO)
VH: P2.1 P3.1
BCLK_P: P1.9(9/RX2/CS/PWM) U1.24(I2S_SCLK)
C1N: C8.1 U2.26(C1N)
clockBat: P1.VBat(Vbat)
CS_P: P1.10(10/TX2/CS/PWM) P8.2(CS)
D+P: P6.3(D+) P7.1
D-P: P6.2(D-) P7.2
I2SDIN_P: P1.22(22/A8/Touch/PWM) U1.26(I2S_DIN)
I2SDOUT_P: P1.13(13/LED/SCK) U1.25(I2S_DOUT)
IN_L2: C2.2 U1.14(LINEIN_L)
IN_R2: C3.2 U1.13(LINEIN_R)
LED_P: P1.17(17/A3/DDA0/Touch) R11.1
LRCLK_P: P1.23(23/A9/Touch/PWM) U1.23(I2S_LRCLK)
MCLK_P: P1.11(11/DOUT) U1.21(SYS_MCLK)
MISO_P: P1.12(12/DIN) P8.7(DO)
MOSI_P: P1.7(7/RX3/DOUT) P8.3(DI)
OUT+: R2.1 U2.20(OUT+)
OUT-: P5.2 U2.16(OUT-)
OUT_L: C11.2 U1.11(LINEOUT_L)
OUT_R: C12.2 U1.12(LINEOUT_R)
PGM_P: P1.PGM(Program) P4.2
PLAY_POW: R1.2 R9.2 U2.1(SHDN) U3.3(EN)
PLAY_ST: P1.8(8/TX3/DIN)
PLAY_STATUS: P1.2
RXD_R: P1.3(3/TX/PWM)
SCK_P: P1.14(14/A0/SCK) P8.5(SCK)
SCL_P: P1.19(19/A5/SCL0/Touch) R10.1 U1.29(CTRL_CLK)
SDA_P: P1.18(18/A4/SDA0/Touch) R8.1 U1.27(CTRL_DATA)
TXD_R: P1.4(4/RX/PWM)
XVUSB_P: P6.1(VCC)
NetC2_1: C2.1 P2.2
NetC3_1: C3.1 P3.2
NetC6_1: C6.1 U1.10(VAG)
NetC8_2: C8.2 U2.3(C1P)
NetC11_1: C11.1 R4.1
NetC12_1: C12.1 R5.1
NetC15_1: C15.1 U3.4(BYP)
NetC16_2: C16.2 U2.15(SVSS) U2.21(SVSS) U2.24(PVSS)
NetD1_A: D1.A R11.2
NetP5_1: P5.1 R2.2
NetR3_1: R3.1 R4.2 U2.9(IN-)
NetR3_2: R3.2 U2.7(FB-)
NetR5_2: R5.2 R6.1 U2.10(IN+)
NetR6_2: R6.2 U2.12(FB+)
NetR7_2: R7.2 U2.13(FS)

Not connected (* = marked no-connect by the designer): P1 0(0/RX1/Touch) 1(1/TX1/Touch) 3.3V2(3.3V) 5(5/TX1/PWM) 6(6/PWM) 15(15/A1/CS/Touch) 16(16/A2/SCL0/Touch) 20(20/A6/CS/PWM) 21(21/A7/RX1/CS/PWM) A10 A11 A14(A14/DAC) AGND GND2(GND) Vin; P6 4(USB_OTG); P8 1(NC) 8(NC); U1 2(HP_R) 4(HP_VGND) 6(HP_L) 8(NC) 9(NC) 16(MIC_BIAS) 17(NC) 18(CPFILT) 19(NC) 22(NC) 28(NC)

### Notes on the sheet
- I2C address: 0n01010(R/W) where n is pin 31
- (near U1) AGND (pin 7) should be star connected to the jack grounds for LINEIN and LINEOUT, and the the VAG capacitor ground. This node should via to the ground plane at a single point.
- (near P1) Power
- Loggerhead Instruments
- Remora-2 Playback
- 5
- 1.1
- D. Mann
- Labels drawn without touching a wire or pin: DGND

### Library data of the parts
C1 C4-C6 C10 = C0402: as C62 on sheet remora-2; Published: 17-Jul-2002; LatestRevisionDate: 19-Mar-2004; LatestRevisionNote: Silkscreen size reduced.; DatasheetDocument: Mar-2001; PackageDocument: Mar-2001; PackageReference: 0402; Publisher: Altium Limited; Code_JEITA: 0402; Code_IPC: 1005 [0402]; ComponentLink1Description: Manufacturer Link; ComponentLink1URL: http://www.kemet.com/; ComponentLink2Description: Datasheet; ComponentLink2URL: http://www.kemet.com/kemet/web/homepage/kechome.nsf/vapubfilesname/F3102TA.pdf/$file/F3102TA.pdf; Value: 0.1uF
C2 C3 C11-C15 = C0402: as C30 on sheet remora-2-power; Published: 17-Jul-2002; LatestRevisionDate: 19-Mar-2004; LatestRevisionNote: Silkscreen size reduced.; DatasheetDocument: Mar-2001; PackageDocument: Mar-2001; PackageReference: 0402; Publisher: Altium Limited; Code_JEITA: 0402; Code_IPC: 1005 [0402]; ComponentLink1Description: Manufacturer Link; ComponentLink1URL: http://www.kemet.com/; ComponentLink2Description: Datasheet; ComponentLink2URL: http://www.kemet.com/kemet/web/homepage/kechome.nsf/vapubfilesname/F3102TA.pdf/$file/F3102TA.pdf
C7 = Tant0805: Value: 10uF
C8 C9 C16 = C0603: Ceramic Chip Capacitor - Standard; Note: Footprint corresponds to dimensions for bulk cassette packaging. This case size has tightened tolerances.; Published: 17-Jul-2002; LatestRevisionDate: 19-Mar-2004; LatestRevisionNote: Silkscreen size reduced.; DatasheetDocument: Mar-2001; PackageDocument: Mar-2001; PackageReference: 0603; Publisher: Altium Limited; Code_JEITA: 0603; Code_IPC: 1608 [0603]; ComponentLink1Description: Manufacturer Link; ComponentLink1URL: http://www.kemet.com/; ComponentLink2Description: Datasheet; ComponentLink2URL: http://www.kemet.com/kemet/web/homepage/kechome.nsf/vapubfilesname/F3102TA.pdf/$file/F3102TA.pdf
P1 = Teensy3.2_surface_mount
P2 P3 = Header 3: Header, 3-Pin; LatestRevisionDate: 17-Jul-2002; LatestRevisionNote: Re-released for DXP Platform.; Publisher: Altium Limited
P4 = Tactile_B3U-1000: Supplier 1: Digi-Key
P5 P7 = HDR_2x1_2mm: Charging Connector
P6 = microUSB-vert: Molex 105133-0011
P8 = microSD_Molex_hinged: Supplier 1: Digi-Key
R1-R11 = ERJ3RK: as R24 on sheet remora-2; Published: 17-Dec-2003; LatestRevisionDate: 19-Mar-2004; LatestRevisionNote: Silkscreen size reduced.; PackageDocument: Mar-2003; PackageReference: 3-0603; Publisher: Altium Limited; Code_IPC: 1608 [0603]; ComponentLink1Description: Manufacturer Link; ComponentLink1URL: http://www.panasonic.com/industrial/components/resistive_products.htm; ComponentLink2Description: Datasheet; ComponentLink2URL: http://www.panasonic.com/industrial/components/pdf/AOA0000CE2.pdf
U2 = MAX9788: audio amp
U3 = LP3985IM5-3.3: as U12 on sheet remora-2-power; Published: 4-Dec-2008; DatasheetVersion: Aug-2005; PackageVersion: revD, Aug-2008; PackageReference: MF05A; Publisher: Altium Limited; PackageDescription: Molded SOT-23, .115 x .063 x .040 in Body, 5 Lead, .0375 in Pitch; PartNumber: LP3985IM5-3.3; RoHS: O; PinCount: 5; DigiKeyPartNumber: LP3985IM5-3.3CT-ND; ComponentLink1Description: LP3985 Datasheet; ComponentLink1URL: http://www.national.com/ds/LP/LP3985.pdf; ComponentLink2Description: LP3985 Web Page; ComponentLink2URL: http://www.national.com/pf/LP/LP3985.html; ComponentLink3Description: MF05A Package Page; ComponentLink3URL: http://www.national.com/packaging/folders/mf05a.html

## Nets that join several sheets
AGND: teensyRecord (30 pins), teensyPlayback (21 pins)
DGND: remora-2 (14 pins), remora-2-sensors (16 pins), remora-2-power (7 pins), teensyRecord (18 pins), teensyPlayback (11 pins)
POW: remora-2-power (P19.1 P21.1 R18.2), teensyRecord (C35.2 U8.3)
SPOW: remora-2-power (5 pins), teensyRecord (11 pins), teensyPlayback (7 pins)
VA: teensyRecord (C19.1 C22.1 U4.5 U5.5), teensyPlayback (C4.1 U1.5)
VCC: remora-2 (10 pins), remora-2-sensors (9 pins), remora-2-power (C47.1 U12.5)
VDDD: teensyRecord (C17.1 C38.1 U5.30 U9.5), teensyPlayback (C1.1 U1.30)
VDDIO: teensyRecord (C26.1 C31.1 U5.20 U7.5), teensyPlayback (C5.1 U1.20)
VH: teensyRecord (C24.1 P12.1 P14.1 U6.5), teensyPlayback (P2.1 P3.1)
BatV: remora-2 (U20.22), remora-2-power (R20.1 R21.2)
BURN: remora-2 (U20.12), remora-2-sensors (Q2.1)
clockBat: remora-2-sensors (U15.14), remora-2-power (R18.1 R19.2), teensyRecord (P10.VBat), teensyPlayback (P1.VBat)
HALL: remora-2 (U20.1), remora-2-sensors (P22.2)
IMU_INT: remora-2 (U20.11), remora-2-sensors (P30.2)
INTA: remora-2 (U20.32), remora-2-sensors (R22.2 U15.3)
PLAY_POW: remora-2 (U20.9), teensyPlayback (R1.2 R9.2 U2.1 U3.3)
PLAY_ST: remora-2 (U20.24), teensyPlayback (P1.8)
PLAY_STATUS: remora-2 (U20.19), teensyPlayback (P1.2)
REC_STATUS: remora-2 (U20.23), teensyRecord (P10.2)
RXD: remora-2 (P29.3 U20.30), teensyRecord (P10.1)
RXD_R: teensyRecord (P10.4), teensyPlayback (P1.3)
SCL: remora-2 (R28.1 U20.28), remora-2-sensors (5 pins)
SDA: remora-2 (R26.1 U20.27), remora-2-sensors (5 pins)
TEENSY_POW: remora-2 (U20.10), teensyRecord (7 pins)
TEENSY_ST: remora-2 (U20.13), teensyRecord (P10.8)
TXD: remora-2 (P29.2 U20.31), teensyRecord (P10.0)
TXD_R: teensyRecord (P10.3), teensyPlayback (P1.4)